# EAGLE design I2CSDCardModule (EAGLE 7.6.0)
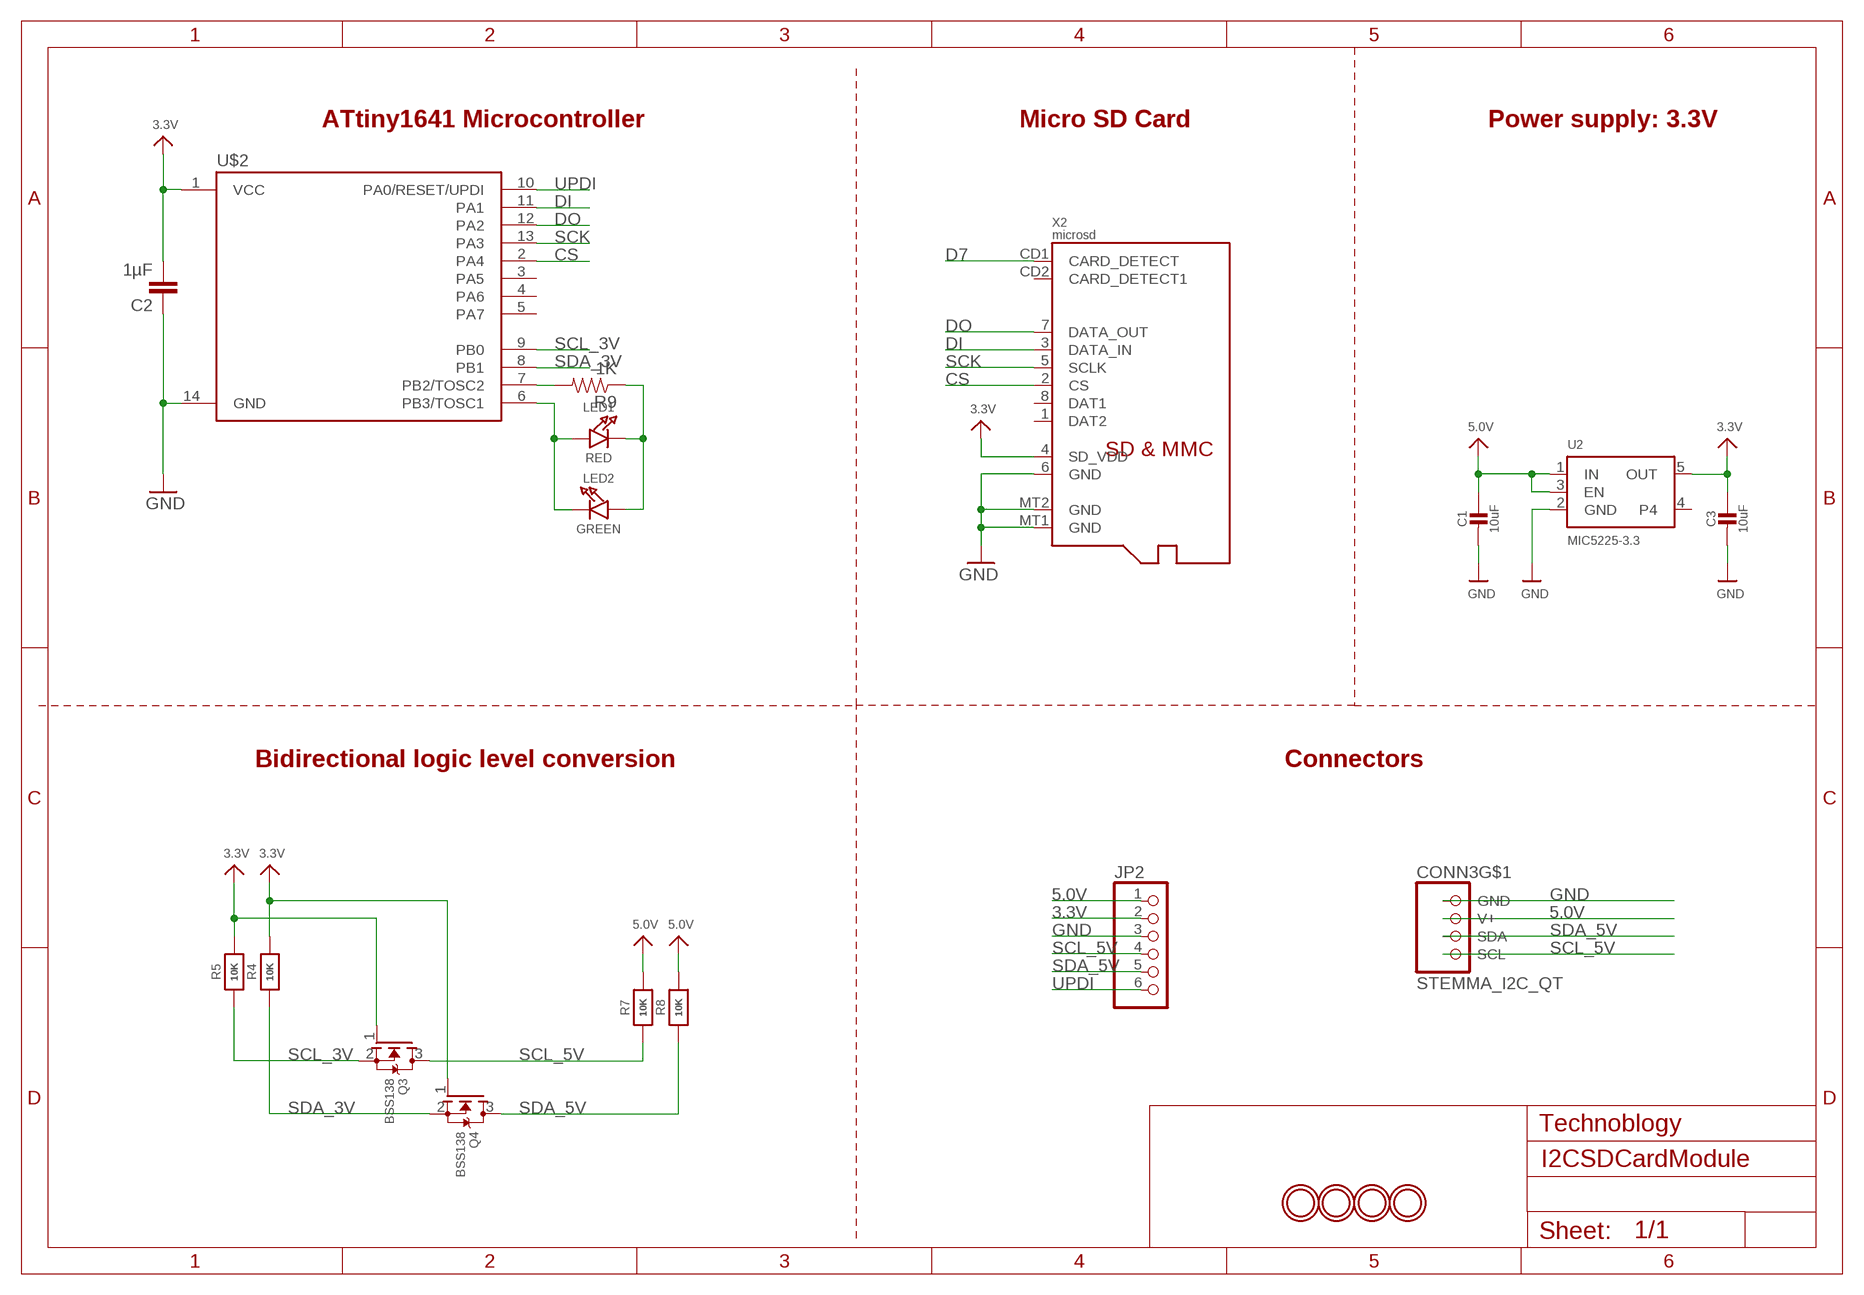
[diagram p0: schematic, sheet 1]

## Parts
C1  10uF  CAP_CERAMIC0805-NOOUTLINE  [0805-NO]
C2  1µF  CAP0805  [0805]
C3  10uF  CAP_CERAMIC0805-NOOUTLINE  [0805-NO]
CONN3  STEMMA_I2C_QT  [JST_SH4]
JP2  HEADER-1X6ROUND  [1X06_ROUND]
LED1  RED  LED0805_NOOUTLINE  [CHIPLED_0805_NOOUTLINE]
LED2  GREEN  LED0805_NOOUTLINE  [CHIPLED_0805_NOOUTLINE]
Q3  BSS138  MOSFET-NWIDE  [SOT23-WIDE]
Q4  BSS138  MOSFET-NWIDE  [SOT23-WIDE]
R4  10K  RESISTOR0805_NOOUTLINE  [0805-NO]
R5  10K  RESISTOR0805_NOOUTLINE  [0805-NO]
R7  10K  RESISTOR0805_NOOUTLINE  [0805-NO]
R8  10K  RESISTOR0805_NOOUTLINE  [0805-NO]
R9  1K  0.3OHM-1/8W-1%(0805)  [0805]
U2  MIC5225-3.3  VREG_SOT23-5  [SOT23-5]
U$1  MOUNTINGHOLE2.5  [MOUNTINGHOLE_2.5_PLATED]
U$2  ATTINY414  [SO14]
U$5  MOUNTINGHOLE2.5  [MOUNTINGHOLE_2.5_PLATED]
U$6  MOUNTINGHOLE2.5  [MOUNTINGHOLE_2.5_PLATED]
U$9  MOUNTINGHOLE2.5  [MOUNTINGHOLE_2.5_PLATED]
X2  microsd  MICROSD  [MICROSD]

## Nets
3.3V: C2.2 C3.1 JP2.2 Q3.1(G) Q4.1(G) R4.2 R5.2 U2.5(OUT) U$2.1(VCC) X2.4(SD_VDD)
5.0V: C1.1 CONN3.2(V+) JP2.1 R7.2 R8.2 U2.1(IN) U2.3(EN)
CS: U$2.2(PA4) X2.2(CS)
D7: X2.CD1(CARD_DETECT)
DI: U$2.11(PA1) X2.3(DATA_IN)
DO: U$2.12(PA2) X2.7(DATA_OUT)
GND: C1.2 C2.1 C3.2 CONN3.1(GND) JP2.3 U2.2(GND) U$2.14(GND) X2.6(GND) X2.MT1(GND) X2.MT2(GND)
N$1: LED1.A LED2.C U$2.6(PB3/TOSC1)
N$3: LED1.C LED2.A R9.1
N$4: R9.2 U$2.7(PB2/TOSC2)
SCK: U$2.13(PA3) X2.5(SCLK)
SCL_3V: Q3.2(S) R5.1 U$2.9(PB0)
SCL_5V: CONN3.4(SCL) JP2.4 Q3.3(D) R7.1
SDA_3V: Q4.2(S) R4.1 U$2.8(PB1)
SDA_5V: CONN3.3(SDA) JP2.5 Q4.3(D) R8.1
UPDI: JP2.6 U$2.10(PA0/RESET/UPDI)
Unconnected: CONN3.MT1(MT) CONN3.MT2(MT) U2.4 U$2.3(PA5) U$2.4(PA6) U$2.5(PA7) X2.1(DAT2) X2.8(DAT1) X2.CD2(CARD_DETECT1)

## Notes on the sheet
- ATtiny1641 Microcontroller | Micro SD Card | Power supply: 3.3V
- Bidirectional logic level conversion | Connectors
- Technoblogy

## Library data of the parts
C1 C3 = microbuilder:CAP_CERAMIC: Ceramic Capacitors For new designs, use the packages preceded by an '_' character since they are more reliable: The following footprints should be used on most boards: _0402 - Standard footprint for regular board layouts _0603 - Standard footprint for regular board layouts _0805 - Standard footprint for regular board layouts _1206 - Standard footprint for regular board layouts For extremely tight-pitch boards where space is at a premium, the following 'micro-pitch' footprints can be used (smaller pads, no silkscreen outline, etc.): _0402MP - Micro-pitch footprint for very dense/compact boards _0603MP - Micro-pitch footprint for very dense/compact boards _0805MP - Micro-pitch footprint for very dense/compact boards _1206MP - Micro-pitch footprint for very dense/compact boards
C2 = SparkFun-Capacitors:CAP: Capacitor Standard 0603 ceramic capacitor, and 0.1" leaded capacitor.
CONN3 = microbuilder:STEMMA_I2C
JP2 = microbuilder:HEADER-1X6: PIN HEADER
LED1 LED2 = microbuilder:LED: LED 0603 - 0603 Surface Mount Package 2mA: Green LED - Low Power (3.9mcd, 2ma, 1.7Vf) - Digikey: 475-2709-2-ND Orange LED - Low Power (9.8mcd, 2ma, 1.8Vf) - Digikey: 475-1194-2-ND Red LED - Low Power (5mcd, 2ma, 1.8Vf) - Digikey: 475-1195-2-ND Yellow LED - Low Power (7mcd, 2ma, 1.8Vf) - Digikey: 475-1196-2-ND 5mA: Blue LED - Low Power (17mcd, 5ma, 2.9Vf) - Digikey: LNJ937W8CRACT-ND 0805 - 0805 Surface Mount Package 2mA: Red LED (8.8mcd, 2mA, 1.8Vf, Clear) - Low Power [Digikey: 475-2510-1-ND] Green LED (5mcd, 2mA, 1.8Vf, Clear) - Low Power [Digikey: 475-2730-1-ND] Yellow LED (11.3mcd, 2mA, 1.8Vf, Clear) - Low Power [Digikey: 475-2555-1-ND] 20mA: Red LED (104mcd, 20mA, Diffused) - LS R976 [Digikey: 475-1278-6-ND] Red LED (12mcd, 20mA, 2.0Vf, Clear) - APT2012EC [Digikey: 754-1128-1-ND] Green LED (15mcd, 20mA, 2.2Vf, Clear) - APT2012GC [Digikey: 754-1131-1-ND] Orange LED (160mcd, 20mA, 2.1Vf, Clear) - APT2012SECK [Digikey: 754-1130-1-ND] 1206 - 1206 Surface Mount Package Green LED (26mcd, 20mA, Diffused) - LG N971 [Digikey: 475-1407-6-ND] Red LED (15mcd, 20mA, Diffused) - LH N974 [Digikey: 475-1416-6-ND] Cree - Cree High-Power Surface Mount LEDs XPEBWT-L1-0000-00D50 - White 111lm 350mA 2.9Vf 6200K 110° XTEAWT-00-0000-00000LEE3 - White 114lm 350mA 2.85Vf 5000K 115° Everlight - Everlight 45-21 Series Surface Mount LEDs 45-21/QK2C-B2832AC2CB2/2T - Warm White 2000mcd 20mA 3.25Vf 3050K 120° 45-21/LK2C-B38452C4CB2/2T - Nuetral White 2000mcd 20mA 3.25Vf 4150K 120° 45-21/LK2C-B50634C6CB2/2T - Cold White 2200mcd 20mA 3.25Vf 5650K 120° PLCC2 Reverse Mount LS T77K-J1L2-1-0-2-R18-Z - Red 11.25mcd 2mA 1.8Vf 630nm 120° LO T77K-L1M2-24-Z - Orange 19.6mcd 2mA 1.8Vf 606nm 120° LY T77K-K2M1-26-Z - Yellow 15.7mcd 2mA 1.8Vf 587nm 120°
Q3 Q4 = microbuilder:MOSFET-N: N-Channel Mosfet LEGEND VDS: Voltage Drain-Source ID: Drain Current RDS(ON): Drain-Source On-State Resistance VGS(TH): Gate-Source Threshold Voltage CISS: Drain-Source Input Capacitance SOT-23 Name VDS ID RDS(ON) VGS(TH) CISS Order Number 2N7002E 60V 260mA 2.5 Ohm 2.5V @ 250uA 26.7pF @ 25V 2N7002ET1GOSTR-ND BSH103 30V 850mA 400 mOhm 400mV @ 1mA 83pF @ 24V BSH103,235-ND BSS138 60V 320mA 1.6 Ohm 1.5V @ 250uA 50pF @ 10V Mouser: 771-BSS138PW115 DMN2075U-7 20V 4.2A 38 mOhm 1V @ 250 uA 594.3pF @ 10V DMN2075U-7DICT-ND * BSS138 good choice for I2C level-shifting POWERPAK 1212-8 Name VDS ID RDS(ON) VGS(TH) CISS Order Number Si7308DN 60V 6A 58 mOhm 3V @ 250uA 665pF @ 15V SI7308DN-T1-E3CT-ND
R4 R5 R7 R8 = microbuilder:RESISTOR: Resistors For new designs, use the packages preceded by an '_' character since they are more reliable: The following footprints should be used on most boards: _0402 - Standard footprint for regular board layouts _0603 - Standard footprint for regular board layouts _0805 - Standard footprint for regular board layouts _1206 - Standard footprint for regular board layouts For extremely tight-pitch boards where space is at a premium, the following 'micro-pitch' footprints can be used (smaller pads, no silkscreen outline, etc.): _0402MP - Micro-pitch footprint for very dense/compact boards _0603MP - Micro-pitch footprint for very dense/compact boards _0805MP - Micro-pitch footprint for very dense/compact boards _1206MP - Micro-pitch footprint for very dense/compact boards
R9 = SparkFun-Resistors:0.3OHM-1/8W-1%(0805): RES-11622; PROD_ID: RES-11622; VALUE: 0.3
U2 = microbuilder:VREG_SOT23-5: SOT23-5 Fixed Voltage Regulators Part Current Out V Out V In V Dropout θJA (°C/W) TJ (°C) Digikey Part No. ADP121 150mA 3.3V 3.4-5.5V 0.09V @ 150mA -- -- ADP121-AUJZ33R7CT-ND ADP121 150mA 3.0V 3.1-5.5V 0.09V @ 150mA -- -- ADP121-AUJZ30R7CT-ND ADP122 300mA 3.3V 3.4-5.5V 0.085V @ 300mA -- -- ADP122AUJZ-3.3-R7CT-ND ADP1712 300mA 3.3V 3.5-5.5V 0.17V @ 300mA -- -- ADP1712AUJZ-3.3-R7TR-ND AP7311 (Low Cost) 150mA 3.3V 3.5-6V 0.15V @ 150mA -- -- AP7311-33WG-7DICT-ND LD39015M18R 150mA 1.8V 1.9V-5.5V 0.08V @ 100mA -- -- 497-6977-1-ND LP2985A-33DBVR 150mA 3.3V 3.3-16V 0.28V @ 150mA 206 150 296-18479-1-ND MCP1824T-3302E/OT 300mA 3.3V 3.5V-6V 0.2V @ 300mA -- -- MCP1824T-3302E/OTCT-ND MIC5205-2.5YM5 TR 150mA 2.5V 2.7-16V 0.165V @ 150mA -- -- 576-1257-2-ND MIC5205-3.0YM5 TR 150mA 3.0V 3.2V-16V 0.165V @ 150mA -- -- 576-1258-2-ND MIC5205-3.3YM5 TR 150mA 3.3V 3.5V-16V 0.165V @ 150mA -- -- 576-1259-2-ND TPS780330220 150mA 3.3V+2.2V 3.6-5.5V 250mV Max -- -- 296-23332-1-ND TDA3663/N1,135 100mA 3.3V 3.5-45V 0.18V @ 50mA -- -- 568-5343-1-ND Max operating temp can be calculated using θJA, TJ (max junction temperature), and power in watts. Set the "Maximum Ambient Temperature" until it reaches TJ ("Max Junction Temperature"), which is the absolute limit for safe use of the regulator: Heat Sink Temperature Calculator <http://www.daycounter.com/Calculators/Heat-Sink-Temperature-Calculator.phtml> For example, With 12V source into a 3.3V LP2985 and a 30mA load, we are dissipating (12V-3.3V) * 0.03A = 0.261W. With a θJA of 206 °C/W, a TJ of 150°C, and 261mW we can safely use the chip without a heat sink up to 75°C (=147.1°C Junction Temperature).
U$1 U$5 U$6 U$9 = microbuilder:MOUNTINGHOLE: Mounting Hole For #2 screws (0.086"/2.18mm width, 0.094"/2.4mm hole) use 2.5mm; BOM: EXCLUDE
U$2 = technoblogy:ATTINY414: Atmel 14-pin 2/4/8kB flash uC; PROD_ID: IC-11285
X2 = microbuilder:MICROSD: MicroSD/Transflash Card Holder with SPI pinout 3M: 2908-05WB-MG 4UConnector: 19656 Footprint courtesy: Adafruit Industries

## Net classes
1 power: width 0.305 mm

## Board
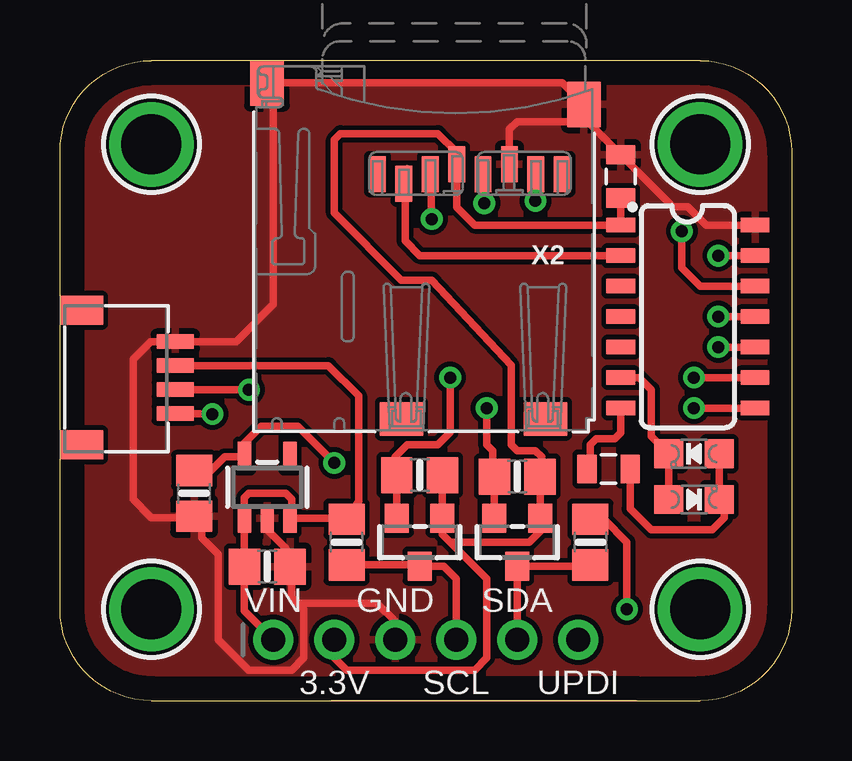
[diagram p1: board, top side]
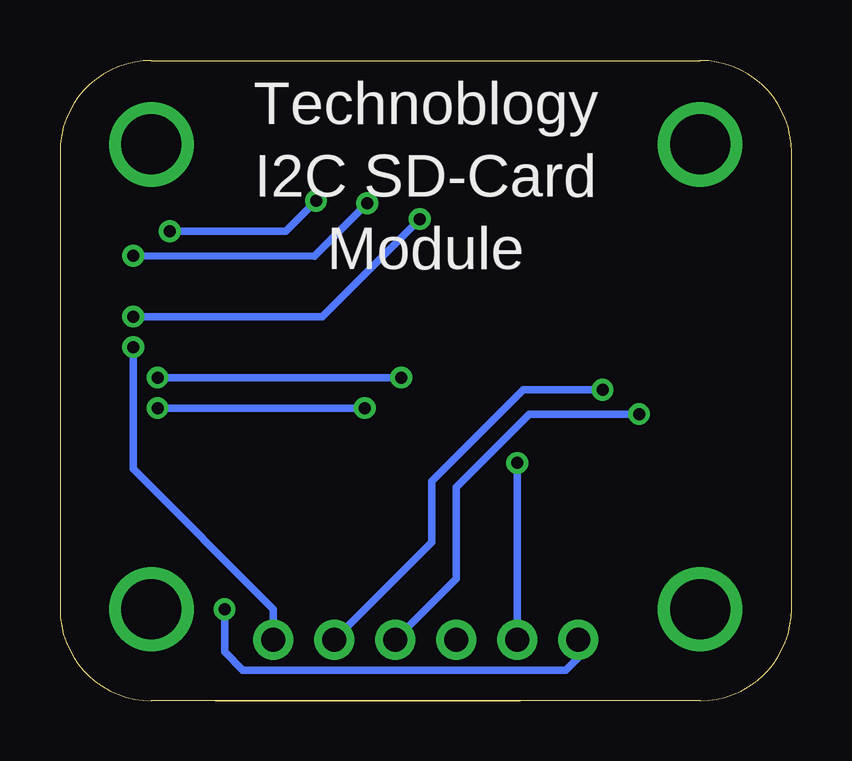
[diagram p2: board, bottom side, seen from below]

Size 30.48 x 26.67 mm. Coordinates in mm from the lower left corner, seen from the top.
Outline: 24,0 11.3,0
Outline: 0,22.86 arc-90 3.81,26.67 26.67,26.67 arc-90 30.48,22.86 30.48,3.81 arc-90 26.67,0 3.81,0 arc-90 0,3.81 0,22.86
Copper layers (1*16): Top 0.035mm / dielectric 1.5mm / Bottom 0.035mm
Design rules "default *": minimum track width 10mil, minimum drill 24mil, track to track 8mil, track to pad 8mil, pad to pad 8mil, via to via 8mil, smd to smd 8mil, copper to edge 40mil, drill to drill 8mil, minimum pad ring 10mil, minimum via ring 8mil, stop-mask expansion 4mil, vias tented up to drill 20mil, thermal gap 10mil

### Footprints (pad centres in the part's own frame; a part is rotated, then mirrored left to right if it is on the bottom)
0805-NO = smd 1.3 x 1.5: 1 -0.95,0; 2 0.95,0
0805 = smd 0.8 x 1.2: 1 -0.9,0; 2 0.9,0
JST_SH4 = smd 0.6 x 1.55: 1 -1.5,2.514; 2 -0.5,2.514; 3 0.5,2.514; 4 1.5,2.514 | smd 1.2 x 1.8: MT1 -2.8,-1.386; MT2 2.8,-1.386
1X06_ROUND = drill 1 pad 1.676: 1 -6.35,0; 2 -3.81,0; 3 -1.27,0; 4 1.27,0; 5 3.81,0; 6 6.35,0
CHIPLED_0805_NOOUTLINE = smd 1.2 x 1.2: A 0,-1.05; C 0,1.05
SOT23-WIDE = smd 1 x 1.2: 1 -0.95,-1; 2 0.95,-1; 3 0,1
SOT23-5 = smd 0.55 x 1.2: 1 -0.95,-1.3; 2 0,-1.3; 3 0.95,-1.3; 4 0.95,1.3; 5 -0.95,1.3
MOUNTINGHOLE_2.5_PLATED = drill 2.5 pad 3.2: P$1 0,0
SO14 = smd 0.6 x 1.2: 1 -3.81,-2.8; 2 -2.54,-2.8; 3 -1.27,-2.8; 4 0,-2.8; 5 1.27,-2.8; 6 2.54,-2.8; 7 3.81,-2.8; 8 3.81,2.8; 9 2.54,2.8; 10 1.27,2.8; 11 0,2.8; 12 -1.27,2.8; 13 -2.54,2.8; 14 -3.81,2.8
MICROSD = smd 0.7 x 1.5: 1 9,-10.64; 2 7.9,-10.24; 3 6.8,-10.64; 4 5.7,-11.04; 5 4.6,-10.64; 6 3.5,-11.04; 7 2.4,-10.64; 8 1.3,-10.64 | smd 1.8 x 1.4: CD1 2,-0.44; CD2 8,-0.44 | smd 1.4 x 1.9: MT1 0.4,-13.54; MT2 13.6,-14.44

### Placement (x,y rotation side)
C1  8.64,5.59 0 top
C2  23.37,21.84 270 top
C3  5.59,8.64 270 top
CONN3  2.29,13.46 270 top
JP2  15.24,2.54 0 top
LED1  26.42,8.38 270 top
LED2  26.42,10.29 90 top
Q3  14.99,6.6 180 top
Q4  19.05,6.6 180 top
R4  19.05,9.33 0 top
R5  14.99,9.4 0 top
R7  11.94,6.6 90 top
R8  22.1,6.6 90 top
R9  22.86,9.65 180 top
U2  8.64,8.89 0 top
U$1  3.81,23.18 0 top
U$2  26.16,16 270 top
U$5  3.81,3.81 0 top
U$6  26.67,3.81 0 top
U$9  26.67,23.18 0 top
X2  22.23,11.3 180 top

### Tracks (layer width: path | path; a pad name or v marks a point on that pad's centre or on a via)
3.3V  (via drill 0.5)
  Top 0.305: 16.26,6.6 19.56,6.6 20.07,7.11 20.07,7.54 Q4.1 R4.2 20.07,9.4 20.07,10.16 19.81,10.41 19.05,10.41 18.8,10.67 18.8,13.97 15.49,17.53 14.22,17.53 11.43,20.32 11.43,23.37 11.68,23.62 15.75,23.62 16.51,22.86 16.51,22.36 X2.4 16.52,20.56 17.27,19.81 U$2.1 C2.2 23.62,20.94 | 15.94,7.69 R5.2 Q3.1 15.94,6.92 16.26,6.6 | v11.43,9.91 9.91,11.43 8.38,11.43 7.69,10.73 U2.5 7.66,10.16 6.86,10.16 6.28,9.59 C3.1 | 16.26,6.6 17.78,5.08 17.78,1.78 17.27,1.27 11.94,1.27 11.43,1.78 JP2.2
  Bottom 0.305: v11.43,9.91 JP2.2
5.0V  (via drill 0.5)
  Top 0.305: JP2.1 7.69,3.74 C1.1 U2.1 7.69,8.45 7.87,8.64 9.4,8.64 9.65,8.38 9.65,7.66 U2.3 11.39,7.59 R7.2 12.45,8.32 12.45,12.7 11.18,13.96 CONN3.2 | R8.2 22.67,7.55 23.62,6.6 v23.62,3.81
  Bottom 0.305: JP2.1 8.89,1.78 9.4,1.27 22.86,1.27 23.62,2.03 v23.62,3.81
CS
  Top 0.305: 14.48,22.15 X2.2 14.38,21.39 14.38,19.15 14.99,18.54 U$2.2
DI  (via drill 0.5)
  Top 0.305: X2.3 15.42,22.17 v15.49,20.07 | v27.43,16 U$2.11
  Bottom 0.305: v15.49,20.07 19.56,16 v27.43,16
DO  (via drill 0.5)
  Top 0.305: U$2.12 26.67,17.27 25.91,18.03 v25.91,19.56 | X2.7 19.83,20.84 v19.81,20.83
  Bottom 0.305: v19.81,20.83 21.08,19.56 v25.91,19.56
GND
  Top 0.305: U2.2 8.64,7.11 9.4,6.35 9.4,5.78 C1.2 9.65,5.52 9.65,4.32 9.91,4.06 | U$2.14 26.92,19.81 26.16,20.57 25.54,20.57 C2.1 22.1,24.01 22.1,24.13 19.05,24.13 18.73,23.8 X2.6 | 9.91,4.06 10.16,3.81 10.16,1.78 9.65,1.27 7.87,1.27 6.6,2.54 6.6,6.1 5.91,6.79 5.91,7.43 C3.2 5.4,7.62 3.81,7.62 3.05,8.38 3.05,14.22 3.79,14.96 CONN3.1 7.34,14.96 8.89,16.51 8.89,25.48 X2.MT2 20.92,25.74 X2.MT1 | JP2.3 13.97,3.3 13.21,4.06 9.91,4.06
  pour Top: 0,26.67 30.48,26.67 30.48,0 0,0
N$1
  Top 0.305: U$2.6 24.13,13.46 24.64,12.95 24.64,11.01 LED2.C | 25.4,10.32 LED2.C | LED2.C LED1.A
N$3
  Top 0.305: R9.1 23.76,7.99 24.64,7.11 27.18,7.11 27.69,7.62 27.69,8.35 LED1.C LED2.A
N$4
  Top 0.305: U$2.7 23.36,11.17 23.11,10.92 22.35,10.92 22.1,10.67 22.1,9.79 R9.2
SCK  (via drill 0.5)
  Top 0.305: X2.5 17.62,21.74 v17.68,20.73 | v27.43,18.54 U$2.13
  Bottom 0.305: v17.68,20.73 19.89,18.52 v27.43,18.54
SCL_3V  (via drill 0.5)
  Top 0.305: Q3.2 R5.1 13.97,9.46 13.97,10.16 14.48,10.67 15.75,10.67 16.26,11.18 v16.26,13.46 | U$2.9 v26.42,13.46
  Bottom 0.305: v26.42,13.46 v16.26,13.46
SCL_5V  (via drill 0.5)
  Top 0.305: R7.1 14.94,5.65 Q3.3 15.99,5.6 16.51,5.08 JP2.4 | CONN3.4 5.82,11.96 v6.35,11.94
  Bottom 0.305: v6.35,11.94 10.92,11.94 13.97,8.89 13.97,5.08 JP2.4
SDA_3V  (via drill 0.5)
  Top 0.305: Q4.2 R4.1 18.03,9.4 18.03,10.41 17.78,10.67 v17.78,12.19 | U$2.8 v26.42,12.19
  Bottom 0.305: v26.42,12.19 v17.78,12.19
SDA_5V  (via drill 0.5)
  Top 0.305: JP2.5 Q4.3 22.05,5.6 R8.1 | CONN3.3 7.1,12.96 v7.87,12.95
  Bottom 0.305: v7.87,12.95 11.18,12.95 14.99,9.14 14.99,6.6 JP2.5
UPDI  (via drill 0.5)
  Top 0.305: v27.43,14.73 U$2.10
  Bottom 0.305: JP2.6 21.59,3.81 27.43,9.65 v27.43,14.73

### Text on the board
tPlace: VIN | GND | SDA | 3.3V | SCL | UPDI
bPlace: Technoblogy / I2C SD-Card / Module